# EAGLE design smoker-pid-control (EAGLE 9.6.2)
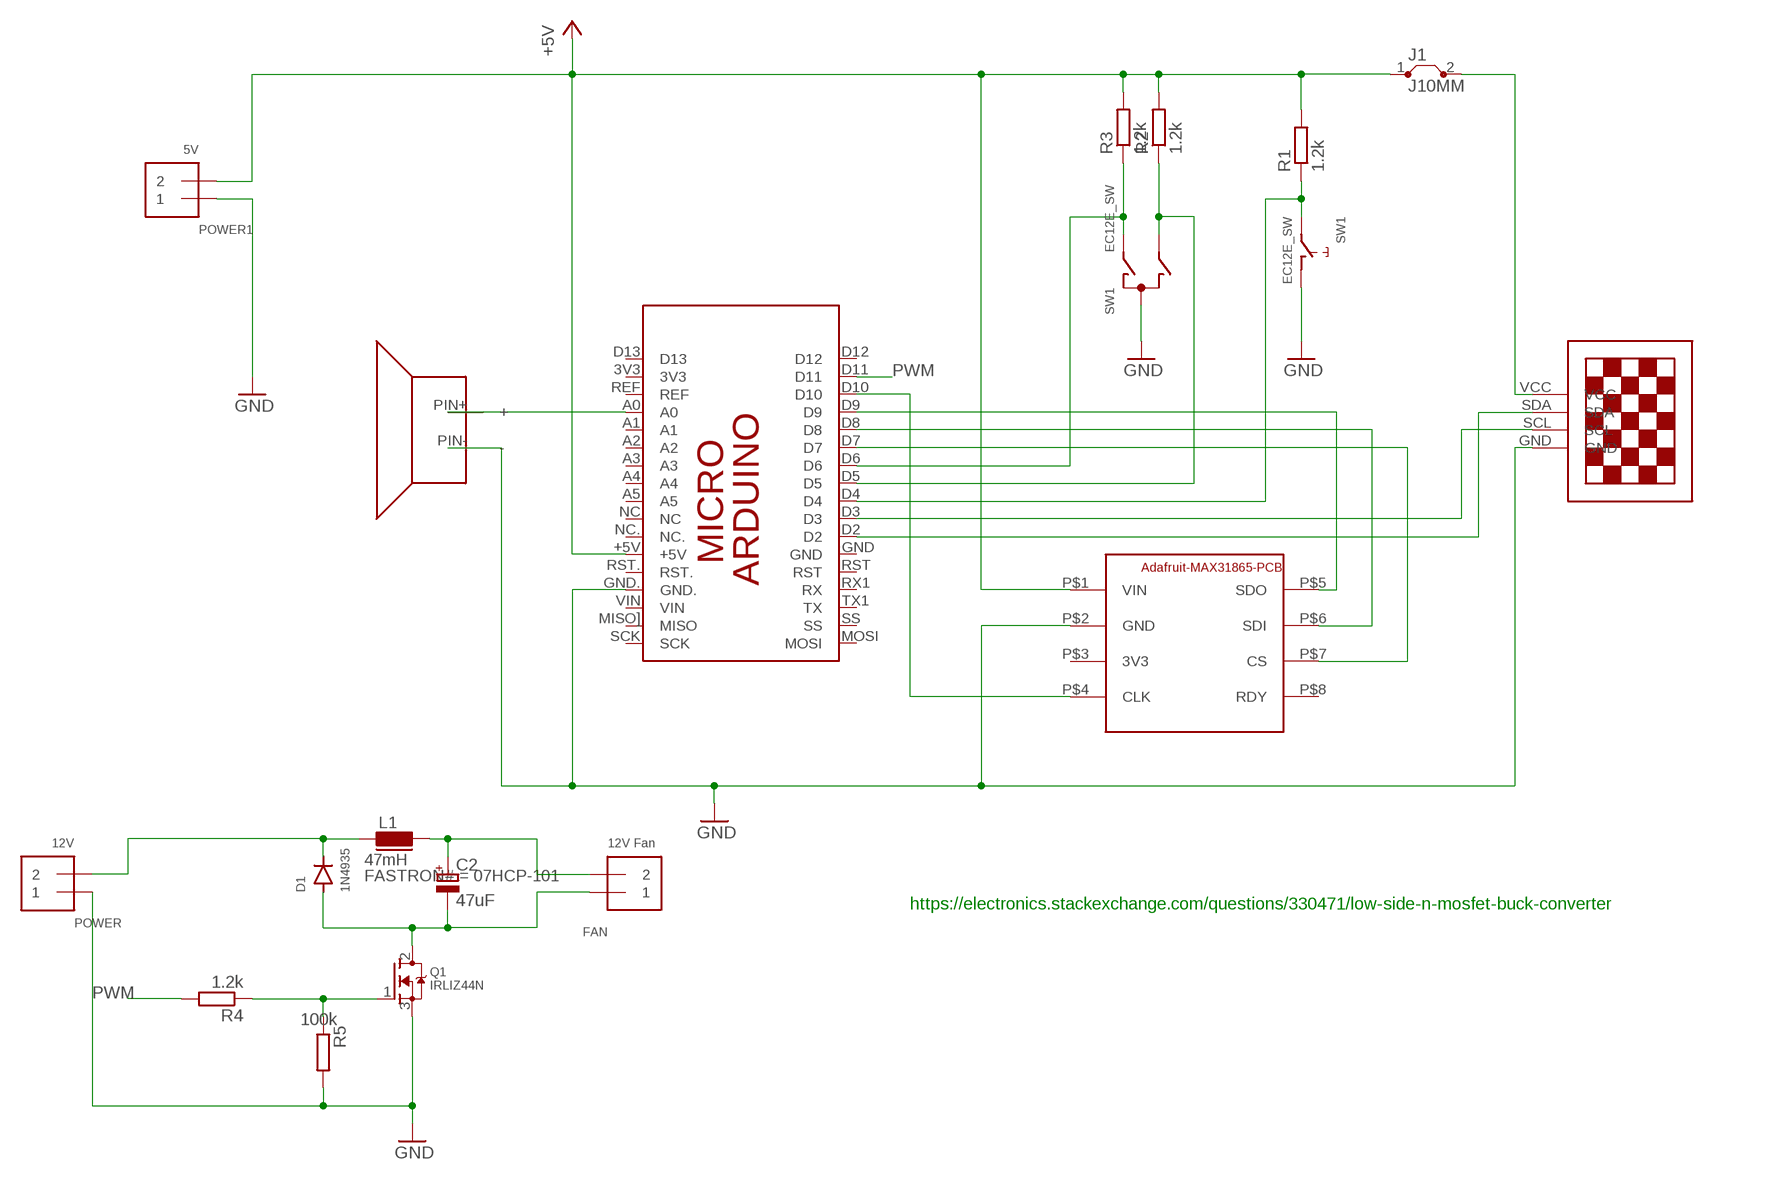
[diagram p0: schematic, sheet 1]

## Parts
C2  47uF  CPOL-EUE5-8.5  [E5-8,5]
D1  1N4935  DIODE-DO34-7  [DO34-7]
FAN  12V Fan  TERMBLOCK_1X2  [TERMBLOCK_1X2-3.5MM]
J1  J10MM  [10]
L1  47mH  07HCP-100U  [FASTRON_07HCP_INDUCTOR]
PCB1  ARDUINO_MICRO  [ARDUINO_MICRO]
POWER  12V  TERMBLOCK_1X2  [TERMBLOCK_1X2-3.5MM]
POWER1  5V  TERMBLOCK_1X2  [TERMBLOCK_1X2-3.5MM]
Q1  IRLIZ44N  MOSFET-NGDS_TO220V  [TO220V]
R1  1.2k  R-EU_0207/10  [0207/10]
R2  1.2k  R-EU_0207/15  [0207/15]
R3  1.2k  R-EU_0207/10  [0207/10]
R4  1.2k  R-EU_0207/10  [0207/10]
R5  100k  R-EU_0207/10  [0207/10]
SW1  EC12E_SW  [ALPS_EC12E_SW]
U$1  ADAFRUIT-MAX31865  [MAX31865-BRD]
U$2  13"OLED13"OLED  [1.3"OLED]
U$3  KC-1206  [KC-1206]

## Nets
+5V: J1.1 PCB1.+5V POWER1.2 R1.2 R2.2 R3.2 U$1.P$1(VIN)
GND: PCB1.GND. POWER1.1 POWER.1 Q1.3(S) R5.2 SW1.C SW1.D U$1.P$2(GND) U$2.GND U$3.PIN-(-)
N$1: PCB1.D2 U$2.SDA
N$2: PCB1.D3 U$2.SCL
N$3: PCB1.D10 U$1.P$4(CLK)
N$4: PCB1.D4 R1.1 SW1.E
N$5: PCB1.D9 U$1.P$5(SDO)
N$6: PCB1.D8 U$1.P$6(SDI)
N$7: PCB1.D7 U$1.P$7(CS)
N$8: PCB1.D5 R2.1 SW1.B
N$9: PCB1.D6 R3.1 SW1.A
N$10: PCB1.A0 U$3.PIN+(+)
N$11: C2.+ FAN.2 L1.2
N$12: Q1.1(G) R4.1 R5.1
N$13: J1.2 U$2.VCC
N$14: C2.- D1.A FAN.1 Q1.2(D)
N$15: D1.C L1.1 POWER.2
PWM: PCB1.D11 R4.2
Unconnected: PCB1.3V3 PCB1.A1 PCB1.A2 PCB1.A3 PCB1.A4 PCB1.A5 PCB1.D12 PCB1.D13 PCB1.GND PCB1.MISO](MISO) PCB1.MOSI PCB1.NC PCB1.NC. PCB1.REF PCB1.RST PCB1.RST. PCB1.RX1(RX) PCB1.SCK PCB1.SS PCB1.TX1(TX) PCB1.VIN SW1.GND1(G) SW1.GND2(G) U$1.P$8(RDY)

## Notes on the sheet
- https://electronics.stackexchange.com/questions/330471/low-side-n-mosfet-buck-converter

## Power pins joined to a net without a drawn wire
3V3: U$1.P$3(3V3)

## Library data of the parts
C2 = rcl:CPOL-EU: POLARIZED CAPACITOR, European symbol; SPICEPREFIX: C
D1 = diode:DIODE-: DIODE
FAN POWER POWER1 = smoker-pid-control:TERMBLOCK_1X2: 3.5mm Terminal block http://www.ladyada.net/library/pcb/eaglelibrary.html
J1 = jumper:J: Bridge
L1 = _fastron_07HCP:07HCP-*: Fastron 07 HCP Series Inductors (Ferrite Core) (1 … 10000)uH, THT vertical assembly, 5 mm grid / 8.3 mm max. diameter / 10 mm max. height RoHS-Compliant Source: www.fastrongroup.co Technologies: 07HCP-… L/uH RDCmax/Ω IN/A Isat/A 1R0 1 0.06 7.5 10 2R2 2.2 0.01 6 8 3R3 3.3 0.013 5 6.3 4R7 4.7 0.018 4 5.4 6R8 6.8 0.025 3.8 6.5 100 10 0.04 2.6 5 220 22 0.055 2.3 3.6 470 47 0.1 1.3 2.5 680 68 0.14 1.1 2.1 820 82 0.16 1 1.9 101 100 0.19 0.9 1.6 121 120 0.22 0.85 1 221 220 0.38 0.64 1.2 331 330 0.7 0.51 0.85 471 470 0.89 0.43 0.8 821 820 1.56 0.36 0.7 102 1000 1.84 0.3 0.5 182 1800 3.3 0.21 0.35 103 10000 24 0.14 0.17 ±10% / ±20% fL = 1 kHz | 0.25 V Author: Dipl.-Ing. FH Rainer Bayer HHN Hochschule Heilbronn, rainer.bayer@hs-heilbronn.de Ingenieurbüro ing-rb, mail@ing-rb.de; FASTRON#: 07HCP-101
PCB1 = smoker-pid-control:ARDUINO_MICRO: Device for representing an Arduino Micro board with a footprint in an EAGLE design. Created by Dave Young for Element14. More EAGLE documentation at: http://www.element14.com/community/community/knode/cadsoft_eagle
Q1 = adafruit:MOSFET-N: N-Channel Mosfet 2N7002E - 60V 260mA SOT23 [Digikey: 2N7002ET1GOSTR-ND] - REEL BSH103 - 30V 850mA SOT23 [Digikey: 568-5013-1-ND]
R1-R5 = rcl:R-EU_: RESISTOR, European symbol; SPICEPREFIX: R
SW1 = smoker-pid-control:EC12E_SW: ALPS rotary Encoder EC12E series with switch; MPN: EC12E2424407; OC_FARNELL: 1520813; OC_NEWARK: 74M1068
U$1 = smoker-pid-control:ADAFRUIT-MAX31865: Adafruit MAX31865 RTD Sensor Breakout https://www.adafruit.com/product/3328
U$2 = smoker-pid-control:13"OLED
U$3 = smoker-pid-control:KC-1206

## Board
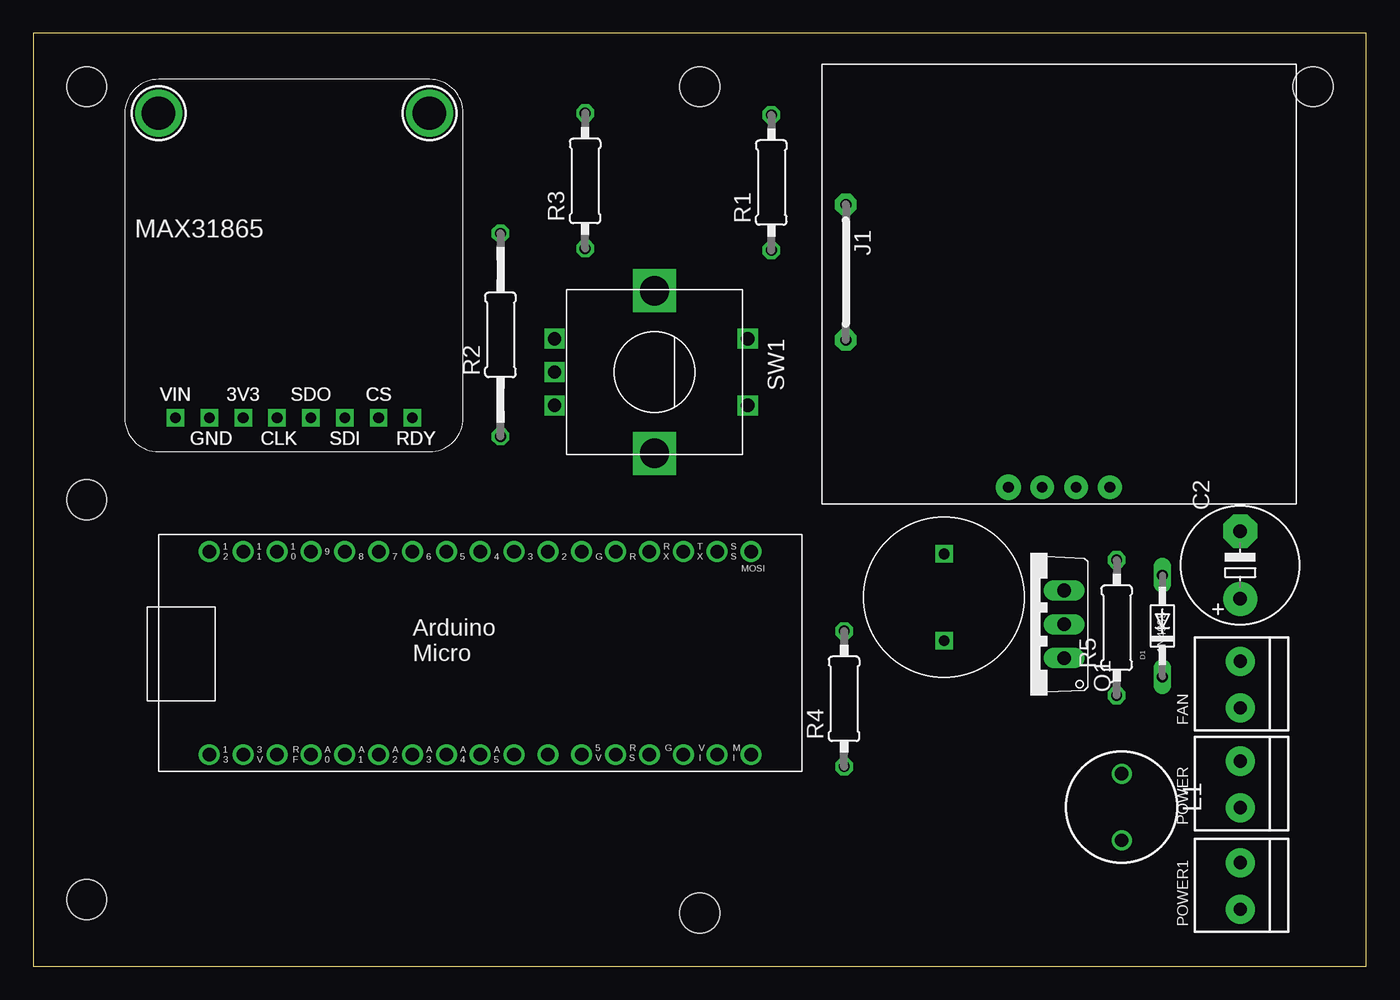
[diagram p1: board, top side]
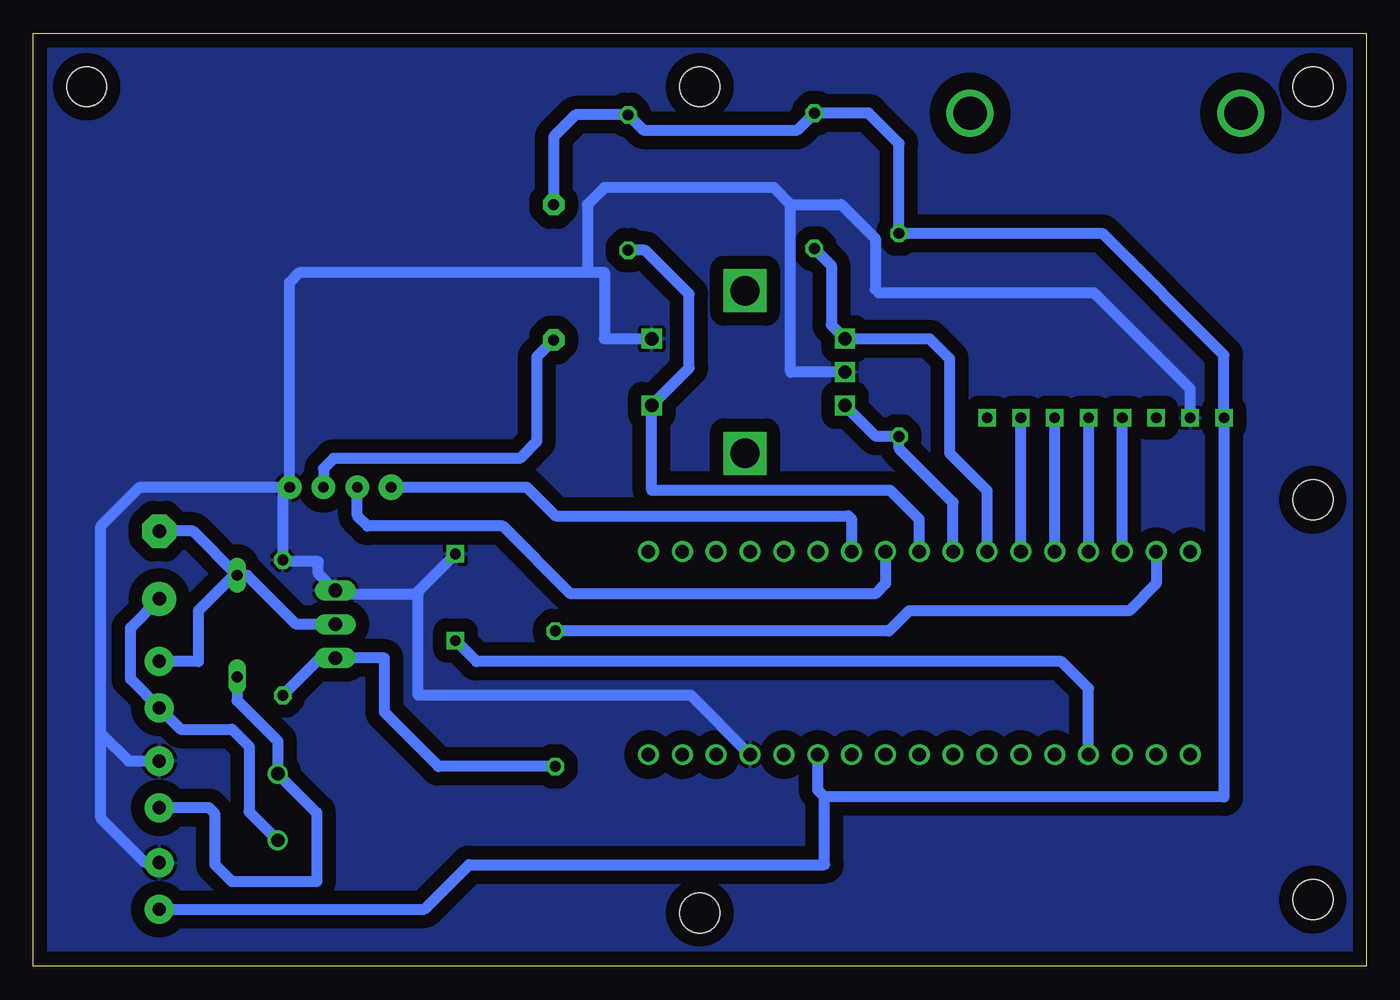
[diagram p2: board, bottom side, seen from below]

Size 100 x 70 mm. Coordinates in mm from the lower left corner, seen from the top.
Outline: 0,0 100,0 100,70 0,70 0,0
Copper layers (1*16): Top 0.035mm / dielectric 1.5mm / Bottom 0.035mm
Design rules "default": minimum track width 6mil, minimum drill 0.35mm, track to track 6mil, track to pad 6mil, pad to pad 6mil, via to via 6mil, smd to smd 6mil, copper to edge 40mil, drill to drill 6mil, minimum pad ring 10mil, minimum via ring 8mil, stop-mask expansion 4mil, vias tented up to drill 0mil, thermal gap 10mil
Holes 0.35 mm at 3.5,665
Holes 3 mm at 50,66 96,66 50,4 4,5 4,35 4,66

### Footprints (pad centres in the part's own frame; a part is rotated, then mirrored left to right if it is on the bottom)
E5-8,5 = drill 1.016 pad 2.54: + -2.54,0 | drill 1.016 pad 2.54 octagon: - 2.54,0
DO34-7 = drill 0.813 long: A 3.81,0; C -3.81,0
TERMBLOCK_1X2-3.5MM = drill 1 pad 2.184: 1 1.8,0; 2 -1.7,0
10 = drill 0.813 pad 1.6 octagon: 1 -5.08,0; 2 5.08,0
FASTRON_07HCP_INDUCTOR = drill 1: 1 -2.5,0; 2 2.5,0
ARDUINO_MICRO = drill 1.016 pad 1.575: 3V3 6.35,1.27; +5V 31.75,1.27; A0 11.43,1.27; A1 13.97,1.27; A2 16.51,1.27; A3 19.05,1.27; A4 21.59,1.27; A5 24.13,1.27; D2 29.21,16.51; D3 26.67,16.51; D4 24.13,16.51; D5 21.59,16.51; D6 19.05,16.51; D7 16.51,16.51; D8 13.97,16.51; D9 11.43,16.51; D10 8.89,16.51; D11 6.35,16.51; D12 3.81,16.51; D13 3.81,1.27; GND 31.75,16.51; GND. 36.83,1.27; MISO] 41.91,1.27; MOSI 44.45,16.51; NC 26.67,1.27; NC. 29.21,1.27; REF 8.89,1.27; RST 34.29,16.51; RST. 34.29,1.27; RX1 36.83,16.51; SCK 44.45,1.27; SS 41.91,16.51; TX1 39.37,16.51; VIN 39.37,1.27
TO220V = drill 1.016 long: 1 -2.54,-2.54; 2 0,-2.54; 3 2.54,-2.54
0207/10 = drill 0.813 octagon: 1 -5.08,0; 2 5.08,0
0207/15 = drill 0.813 octagon: 1 -7.62,0; 2 7.62,0
ALPS_EC12E_SW = drill 1 square: A -2.5,-7.5; B 2.5,-7.5; C 0,-7.5; D -2.5,7; E 2.5,7 | drill 2.2 square: GND1 -6.1,0; GND2 6.1,0
MAX31865-BRD = drill 0.8 square: P$1 -8.89,-11.43; P$2 -6.35,-11.43; P$3 -3.81,-11.43; P$4 -1.27,-11.43; P$5 1.27,-11.43; P$6 3.81,-11.43; P$7 6.35,-11.43; P$8 8.89,-11.43 | drill 2.5 pad 3.2: P$9 -10.16,11.43; P$10 10.16,11.43
1.3"OLED = drill 0.8 pad 1.778: GND 0,0; SCL 5.08,0; VCC 2.54,0 | drill 0.8 pad 1.9: SDA 7.62,0
KC-1206 = drill 0.8 square: PIN+ -3.25,0; PIN- 3.25,0

### Placement (x,y rotation side)
C2  90.55,30.1 90 top
D1  84.71,25.53 90 top
FAN  90.55,21.08 90 top
J1  60.96,52.07 270 top
L1  81.66,11.94 270 top
PCB1  9.4,14.61 0 top
POWER  90.55,13.59 90 top
POWER1  90.55,5.97 90 top
Q1  74.8,25.65 90 top
R1  55.37,58.8 90 top
R2  35.05,47.37 90 top
R3  41.4,58.93 90 top
R4  60.83,20.07 90 top
R5  81.28,25.4 90 top
SW1  46.6,44.58 270 top
U$1  19.56,52.58 0 top
U$2  80.77,35.94 180 top
U$3  68.33,27.69 90 top

### Tracks (layer width: path | path; a pad name or v marks a point on that pad's centre or on a via)
+5V
  Bottom 0.813: J1.1 60.96,62.23 59.31,63.88 R1.2 54.23,62.74 42.67,62.74 R3.2 37.34,64.01 35.05,61.72 R2.2 19.81,54.99 10.67,45.85 U$1.P$1 10.67,12.7 40.64,12.7 | POWER1.2 70.66,4.27 67.31,7.62 40.64,7.62 40.64,12.7 | 40.64,12.7 41.15,13.21 PCB1.+5V
GND
  Bottom 0.61: 36.83,50.8 36.56,50.53
  Bottom 0.813: U$1.P$2 13.21,43.31 20.43,50.53 36.56,50.53 | SW1.C 43.18,44.58 43.18,57.15 | 43.18,57.15 39.37,57.15 36.83,54.61 36.83,50.8 | SW1.D 57.15,47.08 57.15,52.07 58.42,52.07 | 94.93,17.46 94.93,33.02 92.01,35.94 U$2.GND | 94.93,17.46 92.86,15.39 POWER.1 | U$2.GND 80.77,51.31 80.01,52.07 58.42,52.07 | 43.18,57.15 44.45,58.42 57.15,58.42 58.42,57.15 58.42,52.07 | PCB1.GND. 50.67,20.32 71.12,20.32 71.12,27.94 71.32,27.94 | POWER1.1 91.59,7.77 94.93,11.11 94.93,17.46 | U$3.PIN- 71.32,27.94 | U$2.GND 81.28,35.43 R5.2 81.15,30.35 78.61,30.35 78.61,29.46 Q1.3 77.09,27.94 71.32,27.94
  pour Bottom (isolate 1.016): 0.64,69.6 99.19,69.6 99.19,1.14 0.64,1.14
N$1
  Bottom 0.813: U$2.SDA 62.99,35.94 60.83,33.78 38.86,33.78 38.61,33.53 PCB1.D2
N$2
  Bottom 0.813: PCB1.D3 36.07,28.7 36.83,27.94 59.69,27.94 64.77,33.02 74.93,33.02 75.69,33.78 U$2.SCL
N$3
  Bottom 0.813: PCB1.D10 U$1.P$4
N$4
  Bottom 0.813: R1.1 54.1,53.72 50.8,50.42 50.8,44.88 SW1.E 53.6,35.73 35.73,35.73 33.53,33.53 PCB1.D4
N$5
  Bottom 0.813: U$1.P$5 PCB1.D9
N$6
  Bottom 0.813: PCB1.D8 U$1.P$6
N$7
  Bottom 0.813: PCB1.D7 U$1.P$7
N$8
  Bottom 0.813: PCB1.D5 30.99,34.8 35.05,38.86 R2.1 36.77,39.75 SW1.B
N$9
  Bottom 0.813: PCB1.D6 28.45,35.69 31.24,38.48 31.24,45.57 32.75,47.08 SW1.A 40.13,48.11 40.13,52.58 R3.1
N$10
  Bottom 0.813: PCB1.A0 20.83,20.83 22.86,22.86 66.75,22.86 U$3.PIN+
N$11
  Bottom 0.813: C2.+ 92.71,25.4 92.71,21.54 FAN.2 88.95,17.78 85.09,17.78 83.82,16.51 83.82,11.6 L1.2
N$12
  Bottom 0.813: R4.1 69.6,14.99 73.66,19.05 73.66,23.11 Q1.1 78.49,23.11 R5.1
N$13
  Bottom 0.813: J1.2 62.23,45.72 62.23,39.37 63.5,38.1 77.47,38.1 78.23,37.34 U$2.VCC
N$14
  Bottom 0.813: Q1.2 80.26,25.65 83.95,29.34 D1.A | D1.A 88.01,32.64 C2.- | D1.A 84.96,29.34 87.63,26.67 87.63,22.86 90.53,22.86 FAN.1
N$15
  Bottom 0.813: POWER.2 86.82,11.89 86.36,11.43 86.36,7.62 85.09,6.35 78.74,6.35 78.74,11.52 L1.1 81.66,16.89 84.71,19.94 D1.C
PWM
  Bottom 0.813: PCB1.D11 15.75,28.7 17.78,26.67 34.29,26.67 35.81,25.15 R4.2